# EAGLE design controller (EAGLE 6.5.0)
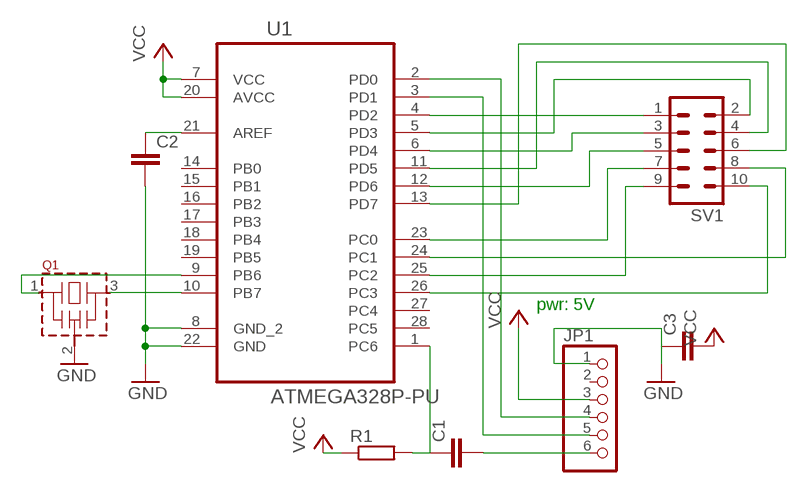
[diagram p0: schematic, sheet 1]

## Parts
C1  C5/3.5  [C5B3.5]
C2  C5/3.5  [C5B3.5]
C3  C5/3.5  [C5B3.5]
JP1  PINHD-1X6/90  [1X06/90]
Q1  CSTLA_X  [CSTLA_T]
R1  R-EU_R0805  [R0805]
SV1  MA05-2  [MA05-2]
U1  ATMEGA328P-PU  [DIP254P762X457-28]

## Nets
GND: C2.2 C3.1 JP1.1 Q1.2(VSS) U1.8(GND_2) U1.22(GND)
N$1: Q1.3 U1.10(PB7)
N$2: Q1.1 U1.9(PB6)
N$3: SV1.1 U1.4(PD2)
N$4: SV1.2 U1.5(PD3)
N$5: SV1.3 U1.6(PD4)
N$6: SV1.4 U1.11(PD5)
N$7: SV1.5 U1.12(PD6)
N$8: SV1.6 U1.13(PD7)
N$9: SV1.7 U1.23(PC0)
N$10: SV1.8 U1.24(PC1)
N$11: SV1.9 U1.25(PC2)
N$12: SV1.10 U1.26(PC3)
N$13: C1.1 R1.2 U1.1(PC6)
N$14: C1.2 JP1.6
N$15: JP1.4 U1.2(PD0)
N$16: JP1.5 U1.3(PD1)
N$17: C2.1 U1.21(AREF)
VCC: C3.2 JP1.3 R1.1 U1.7(VCC) U1.20(AVCC)
Unconnected: JP1.2 U1.14(PB0) U1.15(PB1) U1.16(PB2) U1.17(PB3) U1.18(PB4) U1.19(PB5) U1.27(PC4) U1.28(PC5)

## Notes on the sheet
- pwr: 5V

## Library data of the parts
C1-C3 = capacitor-wima:C: CAPACITOR naming: grid - package width
JP1 = pinhead:PINHD-1X6: PIN HEADER
Q1 = murata-resonators:CSTLA_X: Ceramic resonator 13.01 to 15.99 MHz
R1 = resistor:R-EU_: RESISTOR, European symbol
SV1 = con-lstb:MA05-2: PIN HEADER; OC_FARNELL: unknown; OC_NEWARK: unknown
U1 = Atmel_By_element14_Batch_1-00:ATMEGA328P-PU: 8-bit Microcontroller with In-System Programmable Flash; MPN: ATMEGA328P-PU; OC_FARNELL: 1715487; OC_NEWARK: 15R0268; PACKAGE: PDIP-28; SUPPLIER: Atmel

## Board
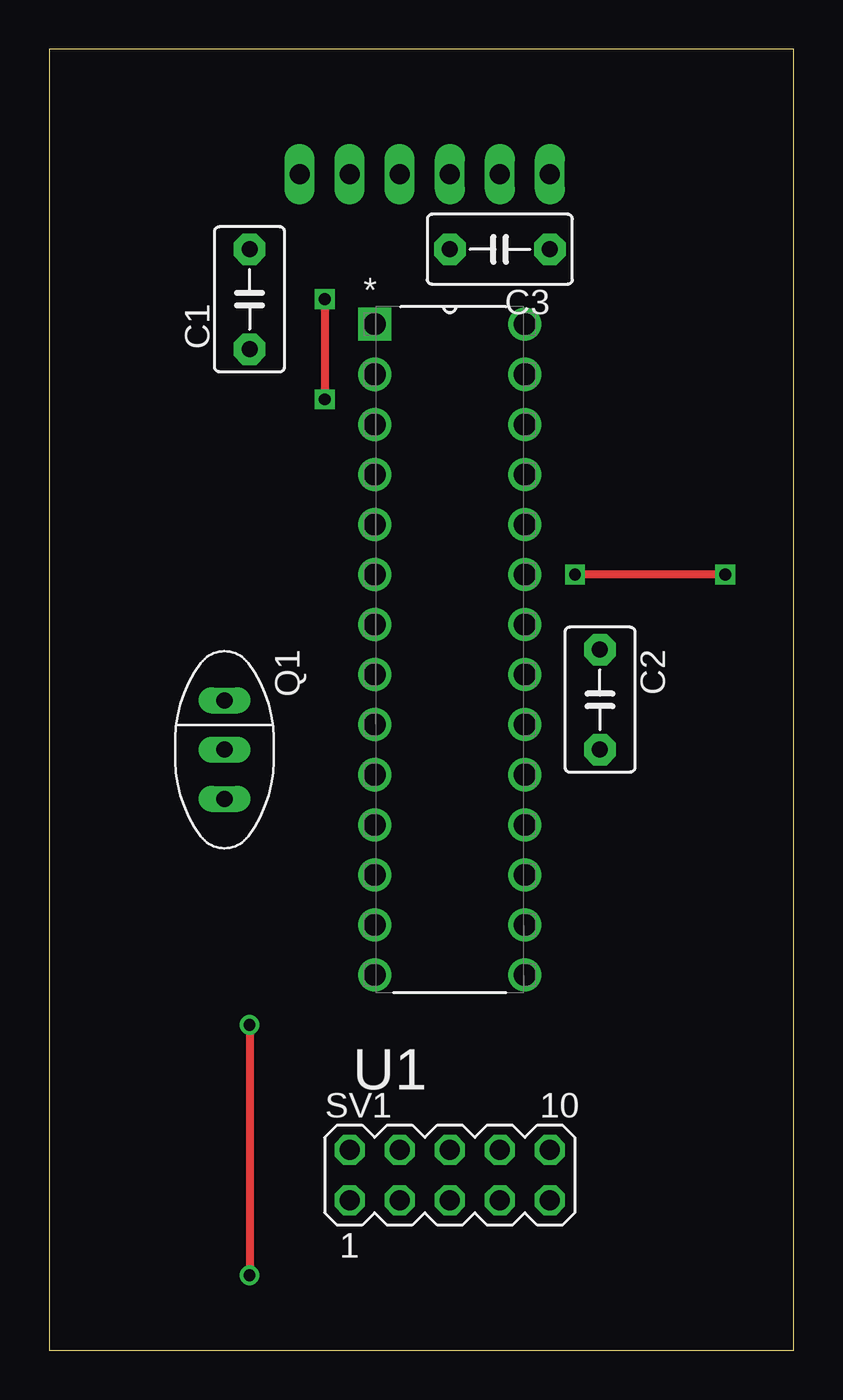
[diagram p1: board, top side]
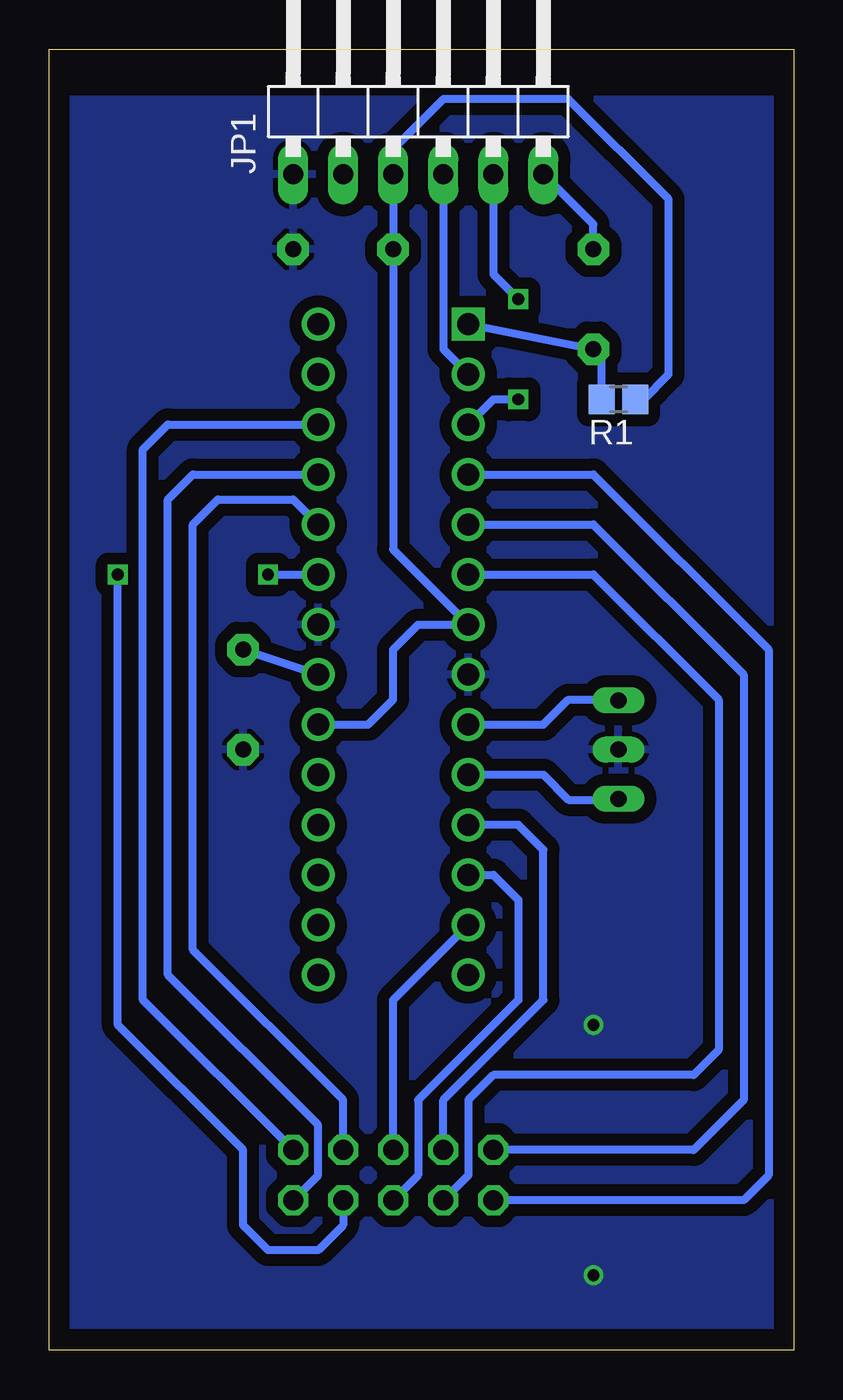
[diagram p2: board, bottom side, seen from below]

Size 37.77 x 66.03 mm. Coordinates in mm from the lower left corner, seen from the top.
Outline: 0,0 37.77,0 37.77,66.03 0,66.03 0,0
Copper layers (1*16): Top 0.035mm / dielectric 1.5mm / Bottom 0.035mm
Design rules "default": minimum track width 10mil, minimum drill 24mil, track to track 8mil, track to pad 8mil, pad to pad 8mil, via to via 8mil, smd to smd 8mil, copper to edge 40mil, drill to drill 8mil, minimum pad ring 10mil, minimum via ring 8mil, stop-mask expansion 4mil, vias tented up to drill 0mil, thermal gap 10mil

### Footprints (pad centres in the part's own frame; a part is rotated, then mirrored left to right if it is on the bottom)
C5B3.5 = drill 0.813 pad 1.6 octagon: 1 -2.54,0; 2 2.54,0
1X06/90 = drill 1.016 long: 1 -6.35,-3.81; 2 -3.81,-3.81; 3 -1.27,-3.81; 4 1.27,-3.81; 5 3.81,-3.81; 6 6.35,-3.81
CSTLA_T = drill 0.813 long: 1 -2.5,0; 2 0,0; 3 2.5,0
R0805 = smd 1.3 x 1.5: 1 -0.85,0; 2 0.85,0
MA05-2 = drill 1.016 octagon: 1 -5.08,-1.27; 2 -5.08,1.27; 3 -2.54,-1.27; 4 -2.54,1.27; 5 0,-1.27; 6 0,1.27; 7 2.54,-1.27; 8 2.54,1.27; 9 5.08,-1.27; 10 5.08,1.27
DIP254P762X457-28 = drill 1.118 square: 1 -7.62,33.02 | drill 1.118: 2 -7.62,30.48; 3 -7.62,27.94; 4 -7.62,25.4; 5 -7.62,22.86; 6 -7.62,20.32; 7 -7.62,17.78; 8 -7.62,15.24; 9 -7.62,12.7; 10 -7.62,10.16; 11 -7.62,7.62; 12 -7.62,5.08; 13 -7.62,2.54; 14 -7.62,0; 15 0,0; 16 0,2.54; 17 0,5.08; 18 0,7.62; 19 0,10.16; 20 0,12.7; 21 0,15.24; 22 0,17.78; 23 0,20.32; 24 0,22.86; 25 0,25.4; 26 0,27.94; 27 0,30.48; 28 0,33.02

### Placement (x,y rotation side)
C1  10.16,53.34 90 top
C2  27.94,33.02 270 top
C3  22.86,55.88 180 top
JP1  19.05,63.5 0 bottom
Q1  8.89,30.48 270 top
R1  8.89,48.26 180 bottom
SV1  20.32,8.89 0 top
U1  24.13,19.05 0 top

### Tracks (layer width: path | path; a pad name or v marks a point on that pad's centre or on a via)
GND  (via drill 0.6)
  Top 0.406: v10.16,16.51 v10.16,3.81
  pour Bottom (isolate 0.61): 0,63.5 0,1.27 36.83,1.27 36.83,63.5
N$1
  Bottom 0.406: U1.10 12.7,29.21 11.43,27.94 8.93,27.94 Q1.3
N$2
  Bottom 0.406: U1.9 12.7,31.75 11.43,33.02 8.93,33.02 Q1.1
N$3
  Bottom 0.406: U1.4 10.16,44.45 1.27,35.56 1.27,8.89 2.54,7.62 SV1.1
N$4
  Bottom 0.406: U1.5 10.16,41.91 2.54,34.29 2.54,12.7 5.08,10.16 SV1.2
N$5
  Bottom 0.406: U1.6 10.16,39.37 3.81,33.02 3.81,15.24 5.08,13.97 15.24,13.97 16.51,12.7 16.51,8.89 SV1.3
N$6
  Bottom 0.406: SV1.4 17.78,12.7 12.7,17.78 12.7,25.4 13.97,26.67 U1.11
N$7
  Bottom 0.406: U1.12 15.24,24.13 13.97,22.86 13.97,17.78 19.05,12.7 19.05,8.89 SV1.5
N$8
  Bottom 0.406: SV1.6 20.32,17.78 U1.13
N$9  (via drill 0.6)
  Top 0.406: v34.29,39.37 v26.67,39.37
  Bottom 0.406: SV1.7 22.86,6.35 24.13,5.08 26.67,5.08 27.94,6.35 27.94,10.16 34.29,16.51 v34.29,39.37 | v26.67,39.37 U1.23
N$10
  Bottom 0.406: SV1.8 22.86,12.7 30.48,20.32 30.48,41.91 29.21,43.18 25.4,43.18 U1.24
N$11
  Bottom 0.406: SV1.9 24.13,8.89 24.13,11.43 31.75,19.05 31.75,43.18 30.48,44.45 U1.25
N$12
  Bottom 0.406: SV1.10 33.02,17.78 33.02,45.72 31.75,46.99 U1.26
N$13
  Bottom 0.406: U1.1 C1.1 9.74,51.22 R1.2
N$14
  Bottom 0.406: C1.2 10.16,57.15 JP1.6
N$15
  Bottom 0.406: JP1.4 17.78,50.8 U1.2
N$16  (via drill 0.6)
  Top 0.406: v13.97,53.34 v13.97,48.26
  Bottom 0.406: JP1.5 15.24,54.61 v13.97,53.34 | v13.97,48.26 15.24,48.26 U1.3
N$17
  Bottom 0.406: C2.1 U1.21
VCC
  Bottom 0.406: R1.1 7.62,48.26 6.35,49.53 6.35,58.42 11.43,63.5 17.78,63.5 20.32,60.96 JP1.3 C3.2 20.32,40.64 U1.7 19.05,36.83 20.32,35.56 20.32,33.02 21.59,31.75 U1.20